# EAGLE design fpa-sao (EAGLE 9.4.1)

## Sheet 1 of 4
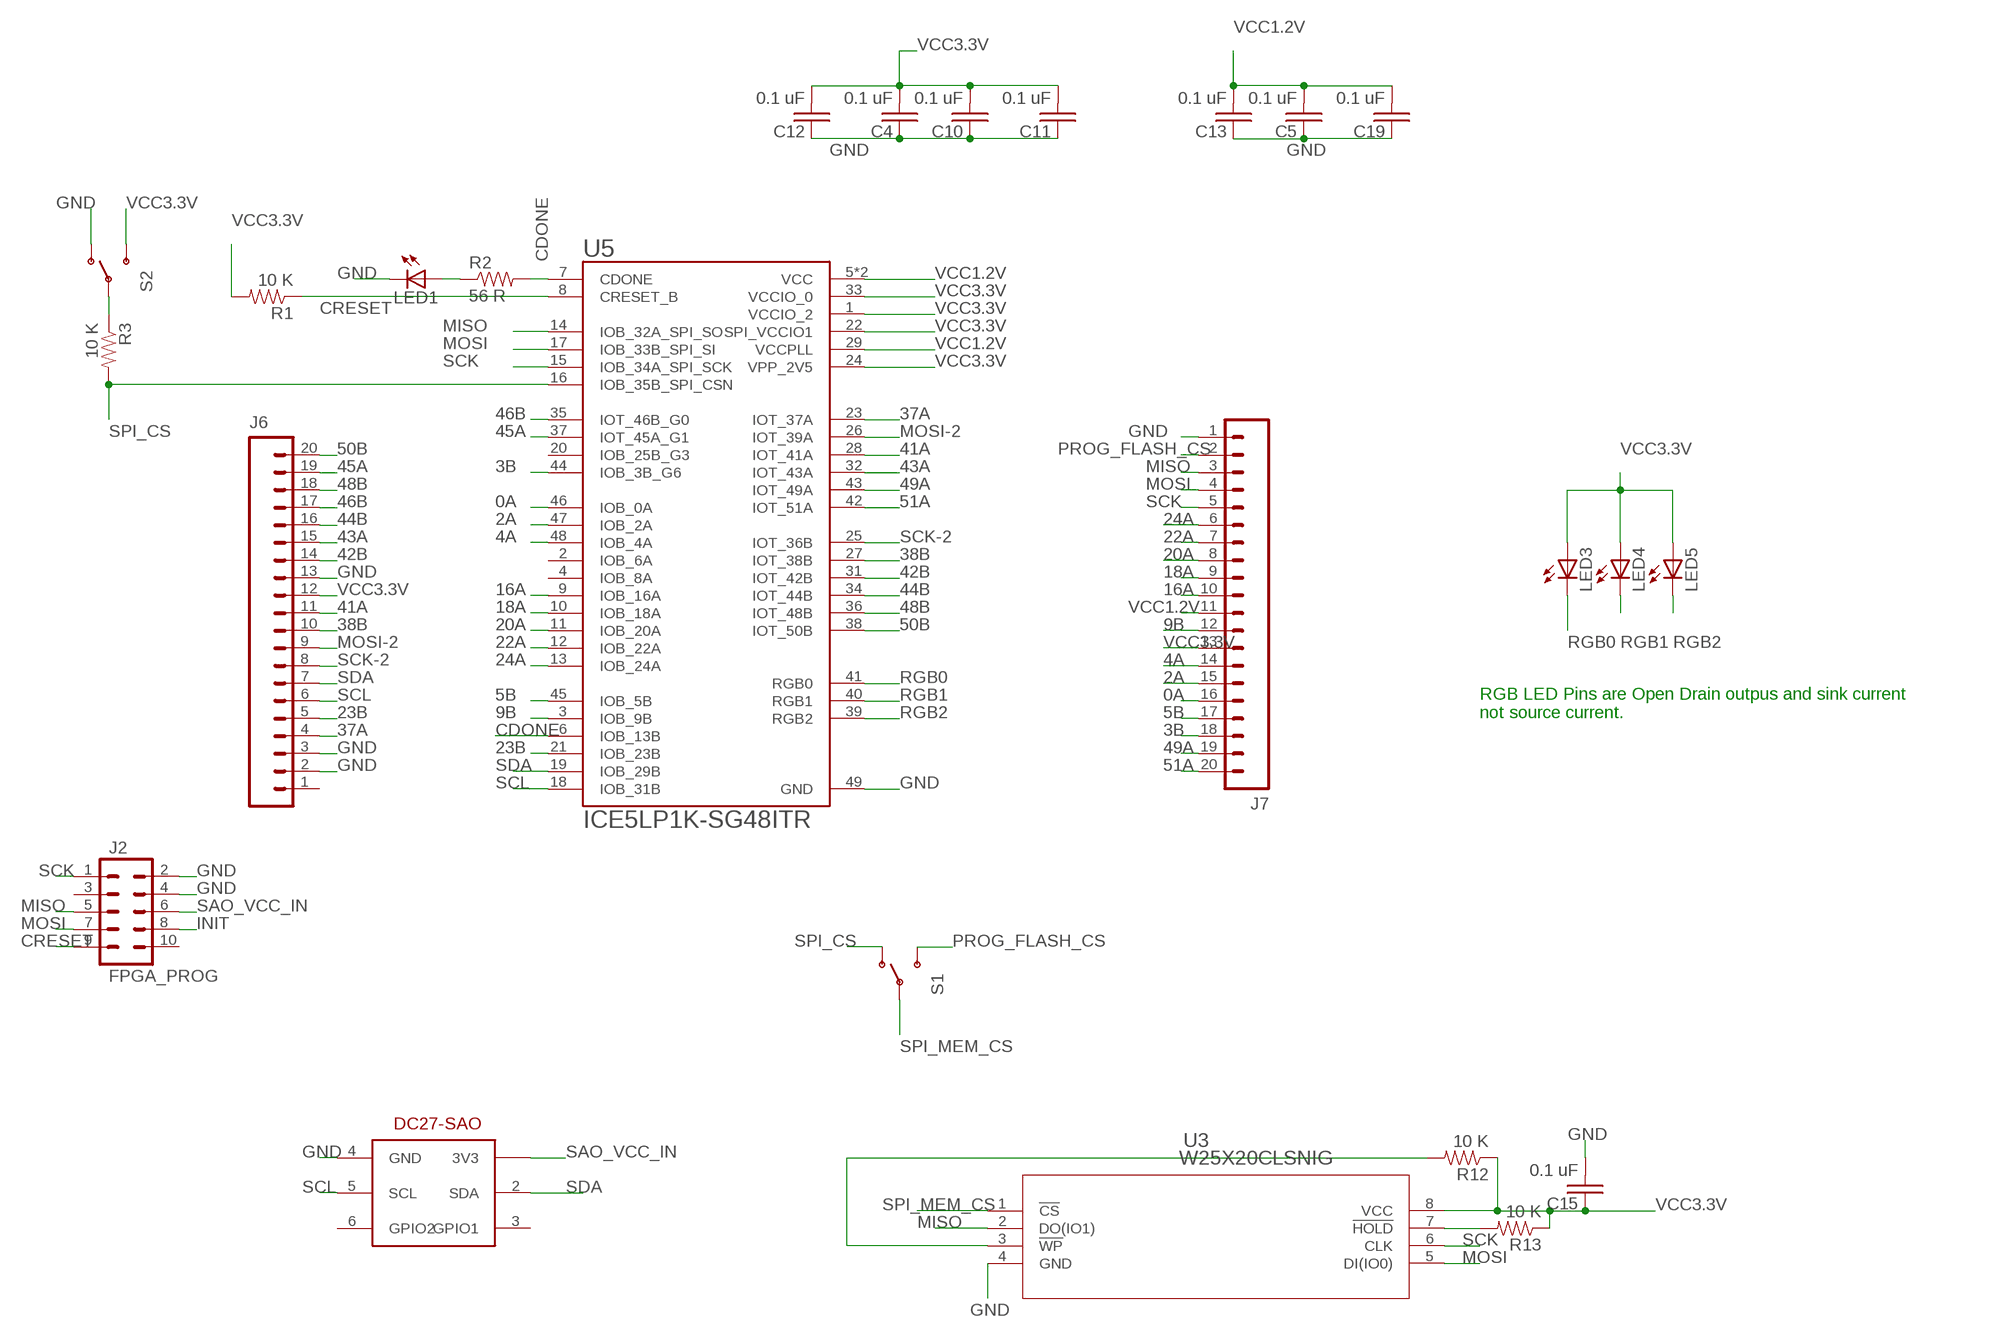
[diagram p0: schematic, sheet 1]

### Parts
C4  0.1 uF  C-USC0603  [C0603]
C5  0.1 uF  C-USC0603  [C0603]
C10  0.1 uF  C-USC0603  [C0603]
C11  0.1 uF  C-USC0603  [C0603]
C12  0.1 uF  C-USC0603  [C0603]
C13  0.1 uF  C-USC0603  [C0603]
C15  0.1 uF  C-USC0603  [C0603]
C19  0.1 uF  C-USC0603  [C0603]
J2  FPGA_PROG  M05X2NO_SILK  [2X5_NOSILK]
J6  M20NO_SILK_KIT  [1X20_NO_SILK_KIT]
J7  M20NO_SILK_KIT  [1X20_NO_SILK_KIT]
LED1  LED1206  [LED-1206]
LED3  LED3MM  [LED3MM]
LED4  LED3MM  [LED3MM]
LED5  LED3MM  [LED3MM]
R1  10 K  RESISTOR0805-RES  [0805]
R2  56 R  RESISTOR1206  [1206]
R3  10 K  RESISTOR0805-RES  [0805]
R12  10 K  RESISTOR0805-RES  [0805]
R13  10 K  RESISTOR0805-RES  [0805]
S1  SWITCH-SPSTKIT  [SWITCH-SPDT_KIT]
S2  SWITCH-SPSTKIT  [SWITCH-SPDT_KIT]
U3  W25X20CLSNIG  [WIN_SN-8]
U5  ICE5LP1K-SG48ITR  [QFN50P700X700X100-49N]
U$1  DC-27-SAO  [3X2]

### Nets
0A: J7.16 U5.46(IOB_0A)
2A: J7.15 U5.47(IOB_2A)
3B: J7.18 U5.44(IOB_3B_G6)
4A: J7.14 U5.48(IOB_4A)
5B: J7.17 U5.45(IOB_5B)
9B: J7.12 U5.3(IOB_9B)
16A: J7.10 U5.9(IOB_16A)
18A: J7.9 U5.10(IOB_18A)
20A: J7.8 U5.11(IOB_20A)
22A: J7.7 U5.12(IOB_22A)
23B: J6.5 U5.21(IOB_23B)
24A: J7.6 U5.13(IOB_24A)
37A: J6.4 U5.23(IOT_37A)
38B: J6.10 U5.27(IOT_38B)
41A: J6.11 U5.28(IOT_41A)
42B: J6.14 U5.31(IOT_42B)
43A: J6.15 U5.32(IOT_43A)
44B: J6.16 U5.34(IOT_44B)
45A: J6.19 U5.37(IOT_45A_G1)
46B: J6.17 U5.35(IOT_46B_G0)
48B: J6.18 U5.36(IOT_48B)
49A: J7.19 U5.43(IOT_49A)
50B: J6.20 U5.38(IOT_50B)
51A: J7.20 U5.42(IOT_51A)
CDONE: R2.2 U5.6(IOB_13B) U5.7(CDONE)
CRESET: J2.9 R1.1 U5.8(CRESET_B)
GND: C4.1 C5.1 C10.1 C11.1 C12.1 C13.1 C15.2 C19.1 J2.2 J2.4 J6.2 J6.3 J6.13 J7.1 LED1.C S2.1(O) U3.4(GND) U5.49(GND) U$1.4(GND) ; also sheet 2,3
INIT: J2.8
MISO: J2.5 J7.3 U3.2(DO(IO1)) U5.14(IOB_32A_SPI_SO)
MOSI: J2.7 J7.4 U3.5(DI(IO0)) U5.17(IOB_33B_SPI_SI) ; also sheet 3
MOSI-2: J6.9 U5.26(IOT_39A) ; also sheet 3
N$1: LED1.A R2.1
N$4: R3.1 S2.2(P)
N$16: R12.2 U3.3(!WP)
N$20: R13.2 U3.7(!HOLD)
PROG_FLASH_CS: J7.2 S1.3(S)
RGB0: LED3.K(C) U5.41(RGB0)
RGB1: LED4.K(C) U5.40(RGB1)
RGB2: LED5.K(C) U5.39(RGB2)
SAO_VCC_IN: J2.6 U$1.1(3V3) ; also sheet 2
SCK: J2.1 J7.5 U3.6(CLK) U5.15(IOB_34A_SPI_SCK) ; also sheet 3
SCK-2: J6.8 U5.25(IOT_36B) ; also sheet 3
SCL: J6.6 U5.18(IOB_31B) U$1.5(SCL)
SDA: J6.7 U5.19(IOB_29B) U$1.2(SDA)
SPI_CS: R3.2 S1.1(O) U5.16(IOB_35B_SPI_CSN)
SPI_MEM_CS: S1.2(P) U3.1(!CS)
VCC1.2V: C5.2 C13.2 C19.2 J7.11 U5.5(VCC) U5.29(VCCPLL) U5.30(VCC) ; also sheet 2
VCC3.3V: C4.2 C10.2 C11.2 C12.2 C15.1 J6.12 J7.13 LED3.A LED4.A LED5.A R1.2 R12.1 R13.1 S2.3(S) U3.8(VCC) U5.1(VCCIO_2) U5.22(SPI_VCCIO1) U5.24(VPP_2V5) U5.33(VCCIO_0) ; also sheet 2,3
Unconnected: J2.3 J2.10 J6.1 U5.2(IOB_6A) U5.4(IOB_8A) U5.20(IOB_25B_G3) U$1.3(GPIO1) U$1.6(GPIO2)

### Notes on the sheet
- RGB LED Pins are Open Drain outpus and sink current 
  not source current.

## Sheet 2 of 4
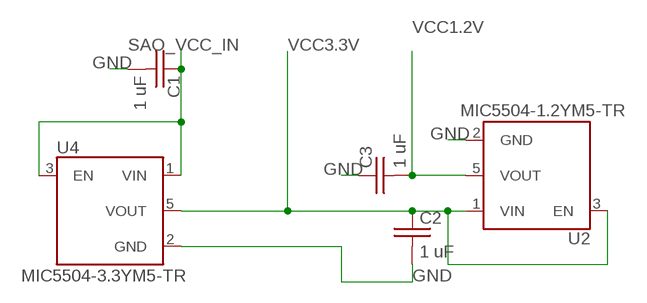
[diagram p1: schematic, sheet 2]

### Parts
C1  1 uF  C-USC0603  [C0603]
C2  1 uF  C-USC0603  [C0603]
C3  1 uF  C-USC0603  [C0603]
U2  MIC5504-1.2YM5-TR  [SOT23-5P95_280X145XL45X37N]
U4  MIC5504-3.3YM5-TR  [SOT23-5P95_280X145XL45X37N]

### Nets
GND: C1.2 C2.2 C3.1 U2.2(GND) U4.2(GND) ; also sheet 1,3
SAO_VCC_IN: C1.1 U4.1(VIN) U4.3(EN) ; also sheet 1
VCC1.2V: C3.2 U2.5(VOUT) ; also sheet 1
VCC3.3V: C2.1 U2.1(VIN) U2.3(EN) U4.5(VOUT) ; also sheet 1,3

## Sheet 3 of 4
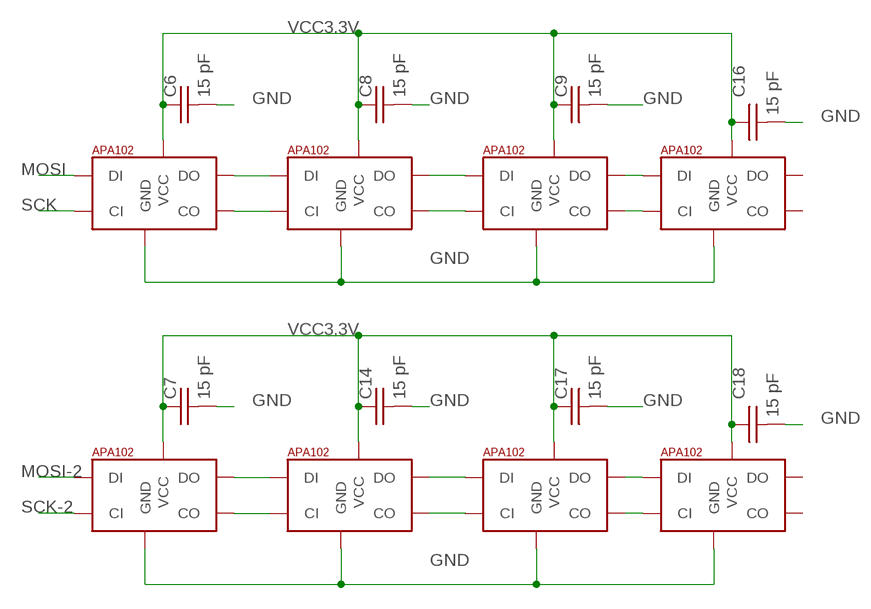
[diagram p2: schematic, sheet 3]

### Parts
C6  15 pF  C-USC1206  [C1206]
C7  15 pF  C-USC1206  [C1206]
C8  15 pF  C-USC1206  [C1206]
C9  15 pF  C-USC1206  [C1206]
C14  15 pF  C-USC1206  [C1206]
C16  15 pF  C-USC1206  [C1206]
C17  15 pF  C-USC1206  [C1206]
C18  15 pF  C-USC1206  [C1206]
U$2  APA1025050  [APA102_5050]
U$3  APA1025050  [APA102_5050]
U$4  APA1025050  [APA102_5050]
U$5  APA1025050  [APA102_5050]
U$6  APA1025050  [APA102_5050]
U$7  APA1025050  [APA102_5050]
U$8  APA1025050  [APA102_5050]
U$10  APA1025050  [APA102_5050]

### Nets
GND: C6.2 C7.2 C8.2 C9.2 C14.2 C16.2 C17.2 C18.2 U$2.6(GND) U$3.6(GND) U$4.6(GND) U$5.6(GND) U$6.6(GND) U$7.6(GND) U$8.6(GND) U$10.6(GND) ; also sheet 1,2
MOSI: U$6.4(DI) ; also sheet 1
MOSI-2: U$2.4(DI) ; also sheet 1
N$5: U$6.2(CO) U$7.5(CI)
N$6: U$6.3(DO) U$7.4(DI)
N$7: U$7.3(DO) U$8.4(DI)
N$8: U$7.2(CO) U$8.5(CI)
N$9: U$2.2(CO) U$3.5(CI)
N$10: U$8.3(DO) U$10.4(DI)
N$11: U$8.2(CO) U$10.5(CI)
N$12: U$2.3(DO) U$3.4(DI)
N$13: U$3.3(DO) U$4.4(DI)
N$14: U$3.2(CO) U$4.5(CI)
N$15: U$4.3(DO) U$5.4(DI)
N$17: U$4.2(CO) U$5.5(CI)
SCK: U$6.5(CI) ; also sheet 1
SCK-2: U$2.5(CI) ; also sheet 1
VCC3.3V: C6.1 C7.1 C8.1 C9.1 C14.1 C16.1 C17.1 C18.1 U$2.1(VCC) U$3.1(VCC) U$4.1(VCC) U$5.1(VCC) U$6.1(VCC) U$7.1(VCC) U$8.1(VCC) U$10.1(VCC) ; also sheet 1,2
Unconnected: U$5.2(CO) U$5.3(DO) U$10.2(CO) U$10.3(DO)

## Sheet 4 of 4
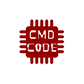
[diagram p3: schematic, sheet 4]

### Parts
U$9  CMD_C0DE_LOGOCMD_CODE_LOGO_SILK  [CMD_C0DE_LOGO_SILK]

## Library data of the parts
C1-C19 = passives:C-US: CAPACITOR, American symbol
J2 = connector:M05X2: Header 5x2 Standard 10-pin dual row 0.1" header. Commonly used with AVR-ISP. Use with Spark Fun Electronics SKU: PRT-00778
J6 J7 = connector:M20: 1x20 .1" header This is just like the LOCK variant in that the holes are staggared by 5 mil, but except for the last two holes. They are not altered from the "standard" footprint layout. This is used for a special purpose on the layout of our Graphic LCD Backpack. Make sure you want to use this device before selecting it for you project!
LED1 LED3-LED5 = leds:LED: LEDs Standard schematic elements and footprints for 5mm, 3mm, 1206, and 0603 sized LEDs. 5mm - Spark Fun Electronics SKU : COM-00529 (and others)
R1-R3 R12 R13 = passives:RESISTOR: Resistor Basic schematic elements and footprints for 0603, 1206, and PTH resistors.
S1 S2 = switches:SWITCH-SPST: SPST Switch Simple slide switch.
U2 = voltage-regulator:MIC5504-1.2YM5-TR: Single 300mA LDO with Enable Pull-Down & Auto Discharge, 5 SOT-23 T/R; AVAILABILITY: Unavailable; DESCRIPTION: Single 300mA LDO with Enable Pull-Down & Auto Discharge, 5 SOT-23 T/R; MF: Microchip; MP: MIC5504-1.2YM5-TR; PACKAGE: SOT-23 Microchip; PRICE: None
U3 = memories:W25X20CLSNIG; MANUFACTURER_PART_NUMBER: W25X20CLSNIG; VENDOR: Winbond
U4 = voltage-regulator:MIC5504-3.3YM5-TR: Single 300mA LDO with Enable Pull-Down & Auto Discharge, 5 SOT-23 T/R; AVAILABILITY: Unavailable; DESCRIPTION: Single 300mA LDO with Enable Pull-Down & Auto Discharge, 5 SOT-23 T/R; MF: Microchip; MP: MIC5504-1.2YM5-TR; PACKAGE: SOT-23 Microchip; PRICE: None
U5 = FPGA:ICE5LP1K-SG48ITR: Ic Fpga 1100luts 1.2v 48qfn; DESCRIPTION: 1100logic cells 48 pin QFN industrial temp reels; DIGI-KEY_PART_NUMBER: 220-2155-1-ND; DIGI-KEY_PURCHASE_URL: https://www.digikey.com/product-detail/en/lattice-semiconductor-corporation/ICE5LP1K-SG48ITR/220-2155-1-ND/8255949?utm_source=snapeda&utm_medium=aggregator&utm_campaign=symbol; MF: Lattice Semiconductor; MP: ICE5LP1K-SG48ITR; PACKAGE: QFN-48 Lattice Semiconductor
U$1 = defcon:DC-27-SAO: DC27SAO device
U$2-U$8 U$10 = leds:APA102: APA102C 5050 RGB LED -- Adafruit DotStar Single LED Pixel Product Page: https://www.adafruit.com/products/2343 Datasheet: https://cdn-shop.adafruit.com/product-files/2343/APA102C.pdf
U$9 = logos:CMD_C0DE_LOGO

## Board
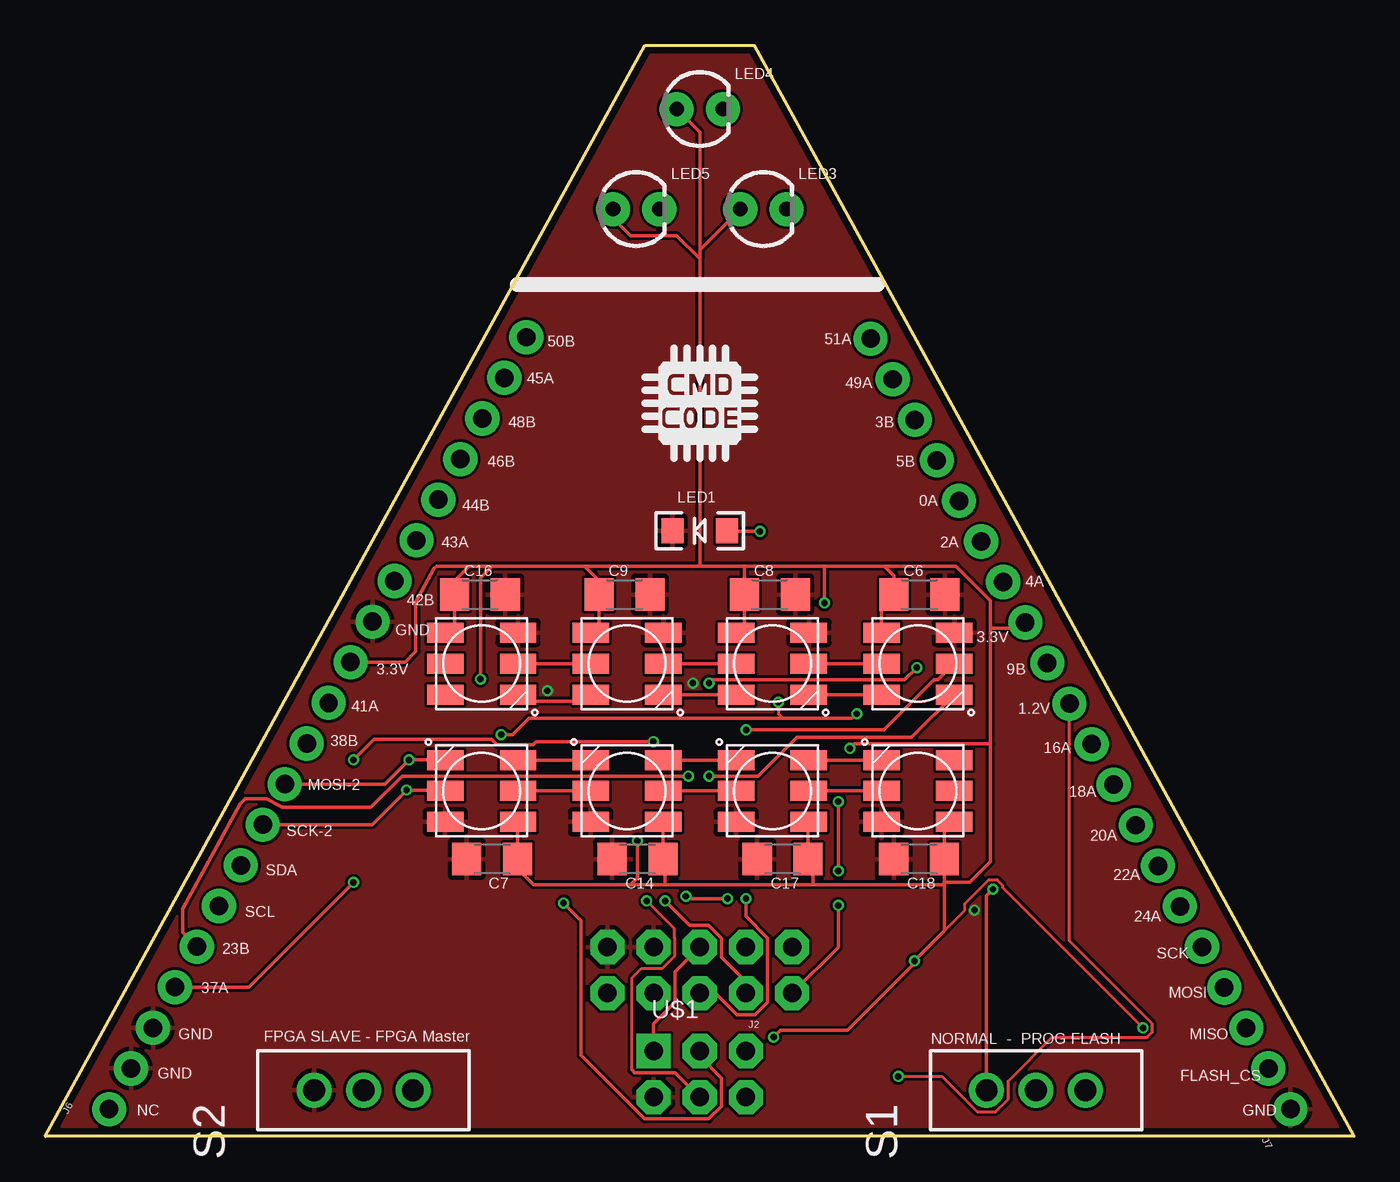
[diagram p4: board, top side]
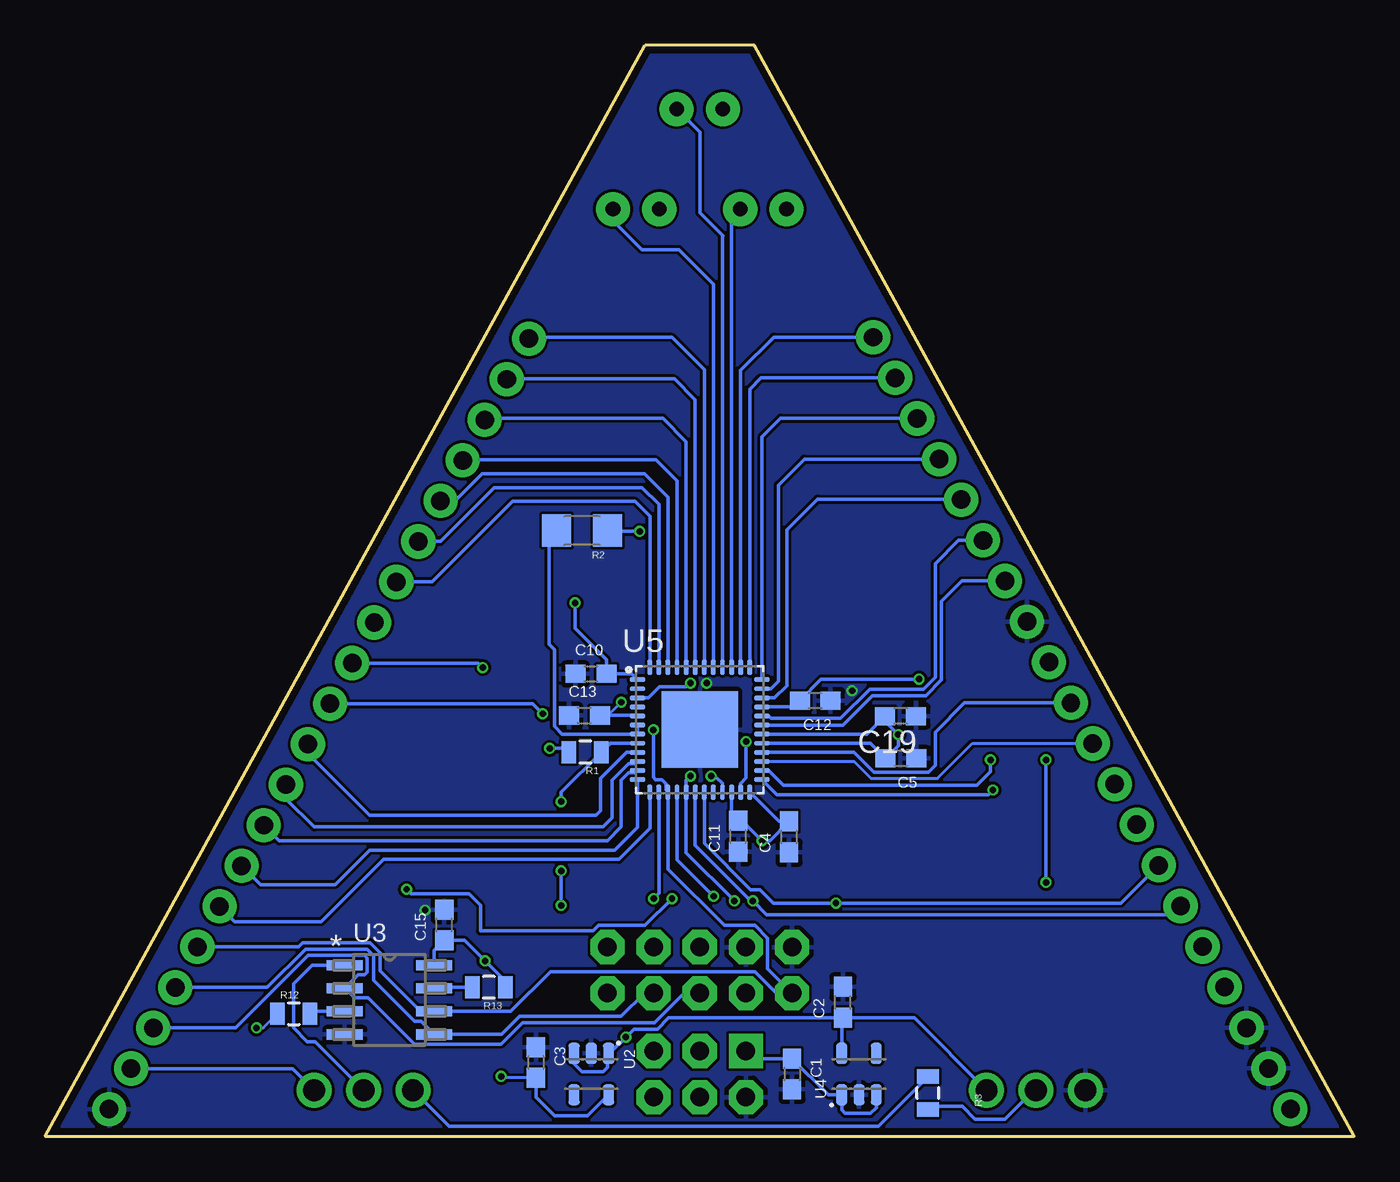
[diagram p5: board, bottom side, seen from below]

Size 72 x 60 mm. Coordinates in mm from the lower left corner, seen from the top.
Outline: 72,0 39,60 33,60 0,0 72,0
Copper layers (1*16): Top 0.035559375mm / dielectric 1.6mm / Bottom 0.035559375mm
Design rules "pcbway": minimum track width 6mil, minimum drill 10mil, track to track 6mil, track to pad 6mil, pad to pad 6mil, via to via 6mil, smd to smd 6mil, copper to edge 15mil, drill to drill 6mil, minimum pad ring 5mil, minimum via ring 5mil, stop-mask expansion 2.5mil, vias tented up to drill 0mil, thermal gap 10mil

### Footprints (pad centres in the part's own frame; a part is rotated, then mirrored left to right if it is on the bottom)
C0603 = smd 1.1 x 1: 1 -0.85,0; 2 0.85,0
C1206 = smd 1.6 x 1.8: 1 -1.4,0; 2 1.4,0
2X5_NOSILK = drill 1.016 pad 1.88 octagon: 1 -1.27,5.08; 2 1.27,5.08; 3 -1.27,2.54; 4 1.27,2.54; 5 -1.27,0; 6 1.27,0; 7 -1.27,-2.54; 8 1.27,-2.54; 9 -1.27,-5.08; 10 1.27,-5.08
1X20_NO_SILK_KIT = drill 1.016 pad 1.88: 1 0,0; 2 2.54,0; 3 5.08,0; 4 7.62,0; 5 10.16,0; 6 12.7,0; 7 15.24,0; 8 17.78,0; 9 20.32,0; 10 22.86,0; 11 25.4,0; 12 27.94,0; 13 30.48,0; 14 33.02,0; 15 35.56,0; 16 38.1,0; 17 40.64,0; 18 43.18,0; 19 45.72,0; 20 48.26,0
LED-1206 = smd 1.2 x 1.4: A -1.5,0; C 1.5,0
LED3MM = drill 0.813 pad 1.88: A -1.27,0; K 1.27,0
0805 = smd 0.8 x 1.2: 1 -0.9,0; 2 0.9,0
1206 = smd 1.6 x 1.8: 1 -1.4,0; 2 1.4,0
SWITCH-SPDT_KIT = drill 1.2 pad 1.93: 1 0,2.718; 2 0,0; 3 0,-2.718
SOT23-5P95_280X145XL45X37N = smd 1.14 x 0.6: 1 -1.14,0.95; 2 -1.14,0; 3 -1.14,-0.95; 4 1.14,-0.95; 5 1.14,0.95
WIN_SN-8 = smd 1.981 x 0.559: 1 -2.464,1.905; 2 -2.464,0.635; 3 -2.464,-0.635; 4 -2.464,-1.905; 5 2.464,-1.905; 6 2.464,-0.635; 7 2.464,0.635; 8 2.464,1.905
QFN50P700X700X100-49N = smd 0.84 x 0.26: 1 -3.435,2.75; 2 -3.435,2.25; 3 -3.435,1.75; 4 -3.435,1.25; 5 -3.435,0.75; 6 -3.435,0.25; 7 -3.435,-0.25; 8 -3.435,-0.75; 9 -3.435,-1.25; 10 -3.435,-1.75; 11 -3.435,-2.25; 12 -3.435,-2.75; 25 3.435,-2.75; 26 3.435,-2.25; 27 3.435,-1.75; 28 3.435,-1.25; 29 3.435,-0.75; 30 3.435,-0.25; 31 3.435,0.25; 32 3.435,0.75; 33 3.435,1.25; 34 3.435,1.75; 35 3.435,2.25; 36 3.435,2.75 | smd 0.26 x 0.84: 13 -2.75,-3.435; 14 -2.25,-3.435; 15 -1.75,-3.435; 16 -1.25,-3.435; 17 -0.75,-3.435; 18 -0.25,-3.435; 19 0.25,-3.435; 20 0.75,-3.435; 21 1.25,-3.435; 22 1.75,-3.435; 23 2.25,-3.435; 24 2.75,-3.435; 37 2.75,3.435; 38 2.25,3.435; 39 1.75,3.435; 40 1.25,3.435; 41 0.75,3.435; 42 0.25,3.435; 43 -0.25,3.435; 44 -0.75,3.435; 45 -1.25,3.435; 46 -1.75,3.435; 47 -2.25,3.435; 48 -2.75,3.435 | smd 4.2 x 4.2: 49 0,0
3X2 = drill 1.016 pad 1.88 square: 1 -2.54,1.27 | drill 1.016 pad 1.88 octagon: 2 0,1.27; 3 2.54,1.27; 4 -2.54,-1.27; 5 0,-1.27; 6 2.54,-1.27
APA102_5050 = smd 2 x 1.1: 1 2,-1.7; 2 2,0; 3 2,1.7; 4 -2,1.7; 5 -2,0; 6 -2,-1.7

### Placement (x,y rotation side)
C1  30.92,3.43 270 bottom
C2  28.13,7.37 90 bottom
C3  45.02,4.06 270 bottom
C4  31.08,16.47 90 bottom
C5  24.92,20.79 180 bottom
C6  48.08,29.8 0 top
C7  24.58,15.25 180 top
C8  39.86,29.8 0 top
C9  31.86,29.8 0 top
C10  41.99,25.44 0 bottom
C11  33.88,16.5 90 bottom
C12  29.65,23.97 180 bottom
C13  42.34,23.15 0 bottom
C14  32.57,15.25 180 top
C15  50.05,11.62 90 bottom
C16  23.9,29.8 0 top
C17  40.56,15.25 180 top
C18  48.07,15.25 180 top
C19  24.95,23.11 180 bottom
J2  36,9.14 90 top
J6  3.5,1.5 61.6 top
J7  68.5,1.5 118.6 top
LED1  36,33.31 180 top
LED3  39.5,51 0 top
LED4  36,56.5 0 top
LED5  32.5,51 0 top
R1  42.31,21.13 180 bottom
R2  42.48,33.32 180 bottom
R3  23.45,2.38 90 bottom
R12  58.34,6.74 0 bottom
R13  47.61,8.21 180 bottom
S1  54.5,2.54 90 top
S2  17.5,2.54 90 top
U2  41.97,3.43 270 bottom
U3  53.07,7.51 0 bottom
U4  27.24,3.43 90 bottom
U5  36,22.37 0 bottom
U$1  36,3.43 0 top
U$2  24,19 0 top
U$3  32,19 0 top
U$4  40,19 0 top
U$5  48,19 0 top
U$6  48,26 180 top
U$7  40,26 180 top
U$8  32,26 180 top
U$9  36,40.64 0 top
U$10  24,26 180 top

### Tracks (layer width: path | path; a pad name or v marks a point on that pad's centre or on a via)
0A
  Bottom 0.2: U5.46 37.75,35.15 39.05,36.45 47.96,36.45 49.46,34.95 J7.16
2A
  Bottom 0.2: U5.47 38.25,34.76 39.17,35.69 47.3,35.69 50.27,32.72 J7.15
3B
  Bottom 0.2: U5.44 36.75,38.22 38.03,39.5 47.74,39.5 J7.18
4A
  Bottom 0.2: U5.48 38.75,33.04 38.75,34.12 39.56,34.92 46.29,34.92 50.72,30.49 J7.14
5B
  Bottom 0.2: U5.45 37.25,36.05 38.41,37.21 49.02,37.21 J7.17
9B  (via drill 0.35)
  Top 0.2: v36.51,24.93 36.68,25.1 47.26,25.1 v47.94,25.78
  Bottom 0.2: v36.51,24.93 36.72,24.72 38.2,24.72 38.81,24.12 U5.3 | v47.94,25.78 48.19,26.03 J7.12
16A
  Bottom 0.2: U5.9 40.03,21.12 41.46,19.68 41.46,17.91 41.72,17.65 54.16,17.65 57.56,21.05 J7.10
18A
  Bottom 0.2: U5.10 39.55,20.5 39.91,20.5 40.83,19.58 40.83,17.53 41.33,17.02 57.21,17.02 58.77,18.58 J7.9
20A
  Bottom 0.2: U5.11 39.55,20 39.91,20 40.32,19.59 40.32,17.02 41.08,16.26 59.13,16.26 J7.8
22A
  Bottom 0.2: U5.12 39.44,17.01 40.7,15.75 54.16,15.75 56.07,13.84 60.17,13.84 J7.7
23B  (via drill 0.35)
  Top 0.2: v35.38,19.82 19.61,19.82 17.89,18.09 13.03,18.09 12.16,18.56 11,18.56 10.73,18.29 7.55,12.52 7.55,11.22 J6.5
  Bottom 0.2: v35.38,19.82 35.3,19.73 35.07,19.73 34.75,19.42 U5.21
24A
  Bottom 0.2: U5.13 38.75,16.93 40.45,15.24 53.4,15.24 56.83,11.81 61.58,11.81 J7.6
37A  (via drill 0.35)
  Top 0.2: v16.95,20.7 18.09,21.84 24.55,21.84 24.85,21.54 26.83,21.54 27.01,21.72 v33.45,21.72 | J6.4 11.18,8.2 v16.95,13.97
  Bottom 0.2: U5.23 33.76,19.41 33.45,19.72 v33.45,21.72 | v16.95,20.7 v16.95,13.97
38B
  Bottom 0.152: U5.27 27.51,20.62 26.57,19.69 22.92,19.69 20.99,21.61 J6.10
41A
  Bottom 0.2: U5.28 27.51,21.12 26.43,20.04 23.42,20.04 23.05,20.41 23.05,22.23 21.43,23.84 J6.11
42B
  Bottom 0.2: U5.31 28.12,22.62 26.5,24.24 23.56,24.24 22.69,25.11 22.69,29.43 21.58,30.55 J6.14
43A
  Bottom 0.2: U5.32 32.22,23.13 32.08,22.99 28.25,22.99 26.65,24.59 23.7,24.59 23.05,25.25 23.05,31.5 21.76,32.78 J6.15
44B
  Bottom 0.2: U5.34 31.88,24.12 31.2,24.8 31.2,33.37 29.52,35.05 21.66,35.05 J6.16
45A
  Bottom 0.2: U5.37 33.25,41.1 32.64,41.72 J6.19
46B
  Bottom 0.2: U5.35 32.08,24.62 31.68,25.02 31.68,35.81 30.25,37.25 J6.17
48B
  Bottom 0.2: U5.36 32.56,38.49 31.55,39.5 24.05,39.5 J6.18
49A
  Bottom 0.2: U5.43 36.25,40.51 37.4,41.66 46.6,41.66 J7.19
50B
  Bottom 0.2: U5.38 33.75,42.13 31.93,43.95 J6.20
51A
  Bottom 0.2: U5.42 35.75,42.17 37.52,43.94 45.33,43.94 J7.20
CDONE
  Bottom 0.2: R2.2 44.3,32.89 44.3,27.07 44,26.77 44,22.99 43.99,22.98 43.99,22.55 43.57,22.12 U5.7 U5.6
CRESET  (via drill 0.35)
  Top 0.2: J2.9 43.62,10.41 v43.62,12.7 | v43.62,14.61 v43.62,18.41
  Bottom 0.2: U5.8 40.92,21.62 R1.1 43.62,18.92 v43.62,18.41 | v43.62,12.7 v43.62,14.61
GND  (via drill 0.35)
  other vias: 51.11,12.45 27.62,24.51 35.62,24.93
  pour Bottom: 0.44,0 0.44,27.94 32.19,59.69 41.08,59.69 72.83,27.94 72.83,0
  pour Top: 0.44,0 0.44,27.94 32.19,59.69 41.08,59.69 72.83,27.94 72.83,26.67 72.83,0
MISO  (via drill 0.35)
  Top 0.2: v38.54,13.08 38.54,12.1 39.73,10.91 39.73,7.38 39.03,6.68 38.05,6.68 36.85,7.87 J2.5
  Bottom 0.2: J2.5 36.85,7.87 38.48,6.25 45.76,6.25 46.94,5.07 51.7,5.07 54.24,7.61 55,7.61 U3.2 54.79,8.88 54.44,8.88 54.29,9.03 54.29,9.8 54.44,9.95 57.55,9.95 61.54,5.96 J7.3 | v38.54,13.08 38.25,13.37 U5.14
MOSI  (via drill 0.35)
  Top 0.2: J2.7 38.54,8.51 37.19,9.86 37.19,10.91 36.49,11.61 35.44,11.61 v34.09,12.95 | U$6.4 47.64,21.94 41.34,21.94 39.21,19.82 v36.51,19.82
  Bottom 0.2: J2.7 39.05,7.87 40.32,6.6 45.91,6.6 46.9,5.61 U3.5 51.34,6.34 51.7,6.34 53.94,8.58 53.94,9.95 54.29,10.3 57.69,10.3 59.8,8.19 J7.4 | v34.09,12.95 36.75,15.61 U5.17 36.75,19.57 v36.51,19.82
MOSI-2  (via drill 0.35)
  Top 0.2: U$2.4 v20,20.7 18.67,19.37 J6.9
  Bottom 0.2: U5.26 32.22,20.13 31.39,19.3 20.76,19.3 20,20.07 v20,20.7
N$1  (via drill 0.35)
  Top 0.2: v39.3,33.27 37.54,33.27 LED1.A
  Bottom 0.2: R2.1 41.03,33.27 v39.3,33.27
N$4
  Bottom 0.2: R3.1 23.28,1.65 21.56,1.65 20.85,0.94 19.2,0.94 17.61,2.54 S2.2
N$5
  Top 0.2: U$7.5 U$6.2
N$6
  Top 0.2: U$7.4 U$6.3
N$7
  Top 0.2: U$8.4 U$7.3
N$8
  Top 0.2: U$8.5 U$7.2
N$9
  Top 0.2: U$3.5 U$2.2
N$10
  Top 0.2: U$8.3 29.62,23.92 26.38,23.92 U$10.4
N$11
  Top 0.2: U$10.5 U$8.2
N$12
  Top 0.2: U$3.4 U$2.3
N$13
  Top 0.2: U$4.4 U$3.3
N$14
  Top 0.2: U$4.5 U$3.2
N$15
  Top 0.2: U$5.4 U$4.3
N$16
  Bottom 0.2: U3.3 57.31,6.88 R12.2
N$17
  Top 0.2: U$5.5 U$4.2
N$20
  Bottom 0.2: R13.2 50.55,8.21 U3.7
PROG_FLASH_CS
  Bottom 0.2: S1.3 58.41,3.73 J7.2
RGB0
  Bottom 0.2: U5.41 35.25,46.88 37.14,48.77 39.17,48.77 40.77,50.36 LED3.K
RGB1
  Bottom 0.2: U5.40 34.75,49.51 34.73,49.53 36,50.8 36,55.23 LED4.K
RGB2
  Bottom 0.2: U5.39 34.25,50.52 LED5.K
SAO_VCC_IN
  Top 0.2: U$1.1 33.46,6.19 34.65,7.38 34.65,9.07 J2.6
  Bottom 0.2: U$1.1 33.04,4.28 C1.1 28.93,2.29 U4.1 28.19,1.46 28,1.27 26.6,1.27 26.29,1.58 U4.3
SCK  (via drill 0.35)
  Top 0.2: U$6.5 49.1,25.1 48.89,25.1 46.14,22.35 v38.55,22.35
  Bottom 0.2: v38.55,22.35 38.55,19.74 38.42,19.61 38.07,19.61 37.87,19.41 37.87,19.05 U5.15 37.75,14.7 34.65,11.61 32.97,11.61 32.27,10.91 32.27,9.22 J2.1 31.77,7.87 32.97,9.07 44.21,9.07 46.4,6.88 U3.6 50.63,6.85 51.32,6.85 53.58,9.12 53.58,10.09 54.14,10.65 57.84,10.65 58.07,10.42 J7.5
SCK-2  (via drill 0.35)
  Top 0.2: U$2.5 21.95,19.05 v19.87,19.05 17.96,17.14 J6.8
  Bottom 0.2: U5.25 31.74,18.8 20.12,18.8 v19.87,19.05
SCL  (via drill 0.35)
  Top 0.152: 32.27,3.65 32.27,8.71 32.8,9.25 33.94,9.25 34.63,9.93 34.63,10.9 34.6,10.92 34.6,11.43 v33.08,12.95
  Top 0.2: 32.27,3.65 32.42,3.51 34.65,3.51 U$1.5
  Bottom 0.2: U5.18 36.25,16 33.21,12.95 v33.08,12.95 32.32,12.19 10.02,12.19 J6.6
SDA  (via drill 0.35)
  Top 0.2: v28.51,12.83 29.47,11.86 29.47,4.46 32.97,0.97 36.49,0.97 37.19,1.67 37.19,3.2 36,4.4 U$1.2
  Bottom 0.2: U5.19 35.75,16.11 33.21,13.58 32.69,13.58 31.94,12.83 v28.51,12.83 12.83,12.83 J6.7
SPI_CS  (via drill 0.35)
  Top 0.2: S1.1 51.78,13.24 v52.13,13.59 | v37.52,13.08 35.37,13.08 v35.24,13.21
  Bottom 0.2: R3.2 26.18,0.56 49.8,0.56 S1.1 | v35.24,13.21 37.25,15.22 U5.16 | v52.13,13.59 51.88,13.34 48.7,13.34 48.06,12.7 48.06,11.3 41.88,11.3 41.57,11.61 39,11.61 v37.52,13.08
SPI_MEM_CS
  Bottom 0.2: S1.2 57.17,5.21 57.59,5.21 58.35,5.97 58.35,8.38 57.32,9.42 U3.1
VCC1.2V  (via drill 0.35)
  Top 0.152: J7.11 56.34,21.58 56.3,21.44 56.34,21.36 56.34,10.76 60.91,6.19 60.91,5.75 60.6,5.44 55.38,5.44 52.98,3.03 52.98,2.05 52.28,1.35 51.29,1.35 49.33,3.3 v46.92,3.3 | v40.32,23.88 40.32,23.24 40.57,22.99
  Top 0.2: v44.64,23.24 44.38,22.99 40.57,22.99 26.6,22.99 25.71,22.1 v25.08,22.1
  Bottom 0.152: C3.2 46.83,3.21 v46.92,3.3 | v40.32,23.88 41.04,23.15 C13.2
  Bottom 0.2: U2.5 42.16,1.14 44,1.14 45.02,2.16 C3.2 | C13.2 39.47,23.15 U5.5 | U5.29 26.6,21.62 C5.2 25.08,21.48 v25.08,22.1 25.8,22.82 C19.2 26.8,22.12 U5.30 | J7.11 45.2,23.8 v44.64,23.24
VCC3.3V  (via drill 0.35)
  Top 0.152: v47.81,9.65 50.58,12.42 50.58,12.79 51.91,14.12 52.35,14.12 52.66,13.81 52.66,13.69 v60.38,5.97
  Top 0.2: v40.06,5.46 40.45,5.84 44.13,5.84 47.81,9.53 v47.81,9.65 49.47,11.31 49.47,13.97 | 49.47,13.97 C18.1 49.47,16.77 U$5.1 | 49.47,13.97 49.34,13.84 42.22,13.84 | 42.22,13.84 34.09,13.84 | 34.09,13.84 32.19,13.84 | 32.19,13.84 26.86,13.84 25.98,14.72 C7.1 25.98,17.28 U$2.1 | U$3.1 33.97,17.27 C14.1 34.09,15.12 34.09,13.84 | U$4.1 41.96,17.26 C17.1 42.22,14.99 42.22,13.84 | 49.47,13.97 50.86,13.97 52,15.11 52,21.59 | 46.16,31.37 50.1,31.37 52,29.47 52,27.94 | 46.16,31.37 42.86,31.37 | 42.86,31.37 38.54,31.37 | 38.54,31.37 36,31.37 | 36,31.37 29.65,31.37 | 29.65,31.37 24.57,31.37 | 24.57,31.37 23.3,31.37 | 23.3,31.37 22.5,30.57 C16.1 22.5,28.2 U$10.1 | 52,21.59 52,27.94 | U$6.1 46,29.12 C6.1 46.68,30.84 46.16,31.37 | 38.54,31.37 38.46,31.29 C8.1 38.46,28.16 U$7.1 | 29.65,31.37 30.46,30.56 C9.1 30.46,28.16 U$8.1 | 42.86,31.37 v42.86,29.34 | 52,21.59 44.51,21.59 v44.26,21.34 | 32.19,13.84 32.57,14.22 v32.57,16.26 | 24.57,31.37 23.94,30.73 v23.94,25.15 | 36,31.37 36,48.26 | 36,48.77 36,48.26 | 36,48.77 LED3.A | 36,48.26 34.73,49.53 32.19,49.53 31.23,50.49 LED5.A | LED4.A 36,55.23 36,48.77 | J7.13 53.59,27.94 52,27.94 | 23.3,31.37 21.52,31.37 21.39,31.24 20.38,29.36 20.38,26.67 19.79,26.08 J6.12
  Bottom 0.152: v60.38,5.97 60.01,5.97 R12.1
  Bottom 0.2: S2.3 24.19,6.52 C2.1 28.25,6.52 | R13.1 46.71,8.55 v47.81,9.65 48.93,10.78 C15.1 50.6,10.22 U3.8 | v42.86,29.34 42.86,27.94 41.14,26.22 C10.2 39.75,25.44 U5.1 | v44.26,21.34 43.41,21.34 R1.2 | v23.94,25.15 29.32,25.15 C12.2 30.84,23.62 U5.33 | U5.22 34.26,18.93 34.26,17.83 33.88,17.45 C11.2 33.66,17.35 v32.57,16.26 32.15,16.26 C4.2 31.64,17.32 U5.24 | 28.25,6.52 37.71,6.52 38.33,5.9 39.63,5.9 v40.06,5.46 40.96,4.57 U2.1 41.08,4.51 41.08,3.81 41.33,3.56 42.48,3.56 42.92,4 U2.3 | U4.5 28.19,6.45 28.25,6.52

### Text on the board
tNames: 51A | 50B | 45A | 49A | 48B | 3B | 46B | 5B | 0A | 44B | 43A | 2A | 4A | 42B | GND | 3.3V | 3.3V | 9B | 41A | 1.2V | 38B | 16A | MOSI-2 | 18A | SCK-2 | 20A | SDA | 22A | SCL | 24A | 23B | SCK | 37A | MOSI | GND | FPGA SLAVE - FPGA Master | NORMAL - PROG FLASH | MISO | GND | FLASH_CS | NC | GND